# EAGLE schematic HE6-RORO1 (EAGLE 9.6.2)
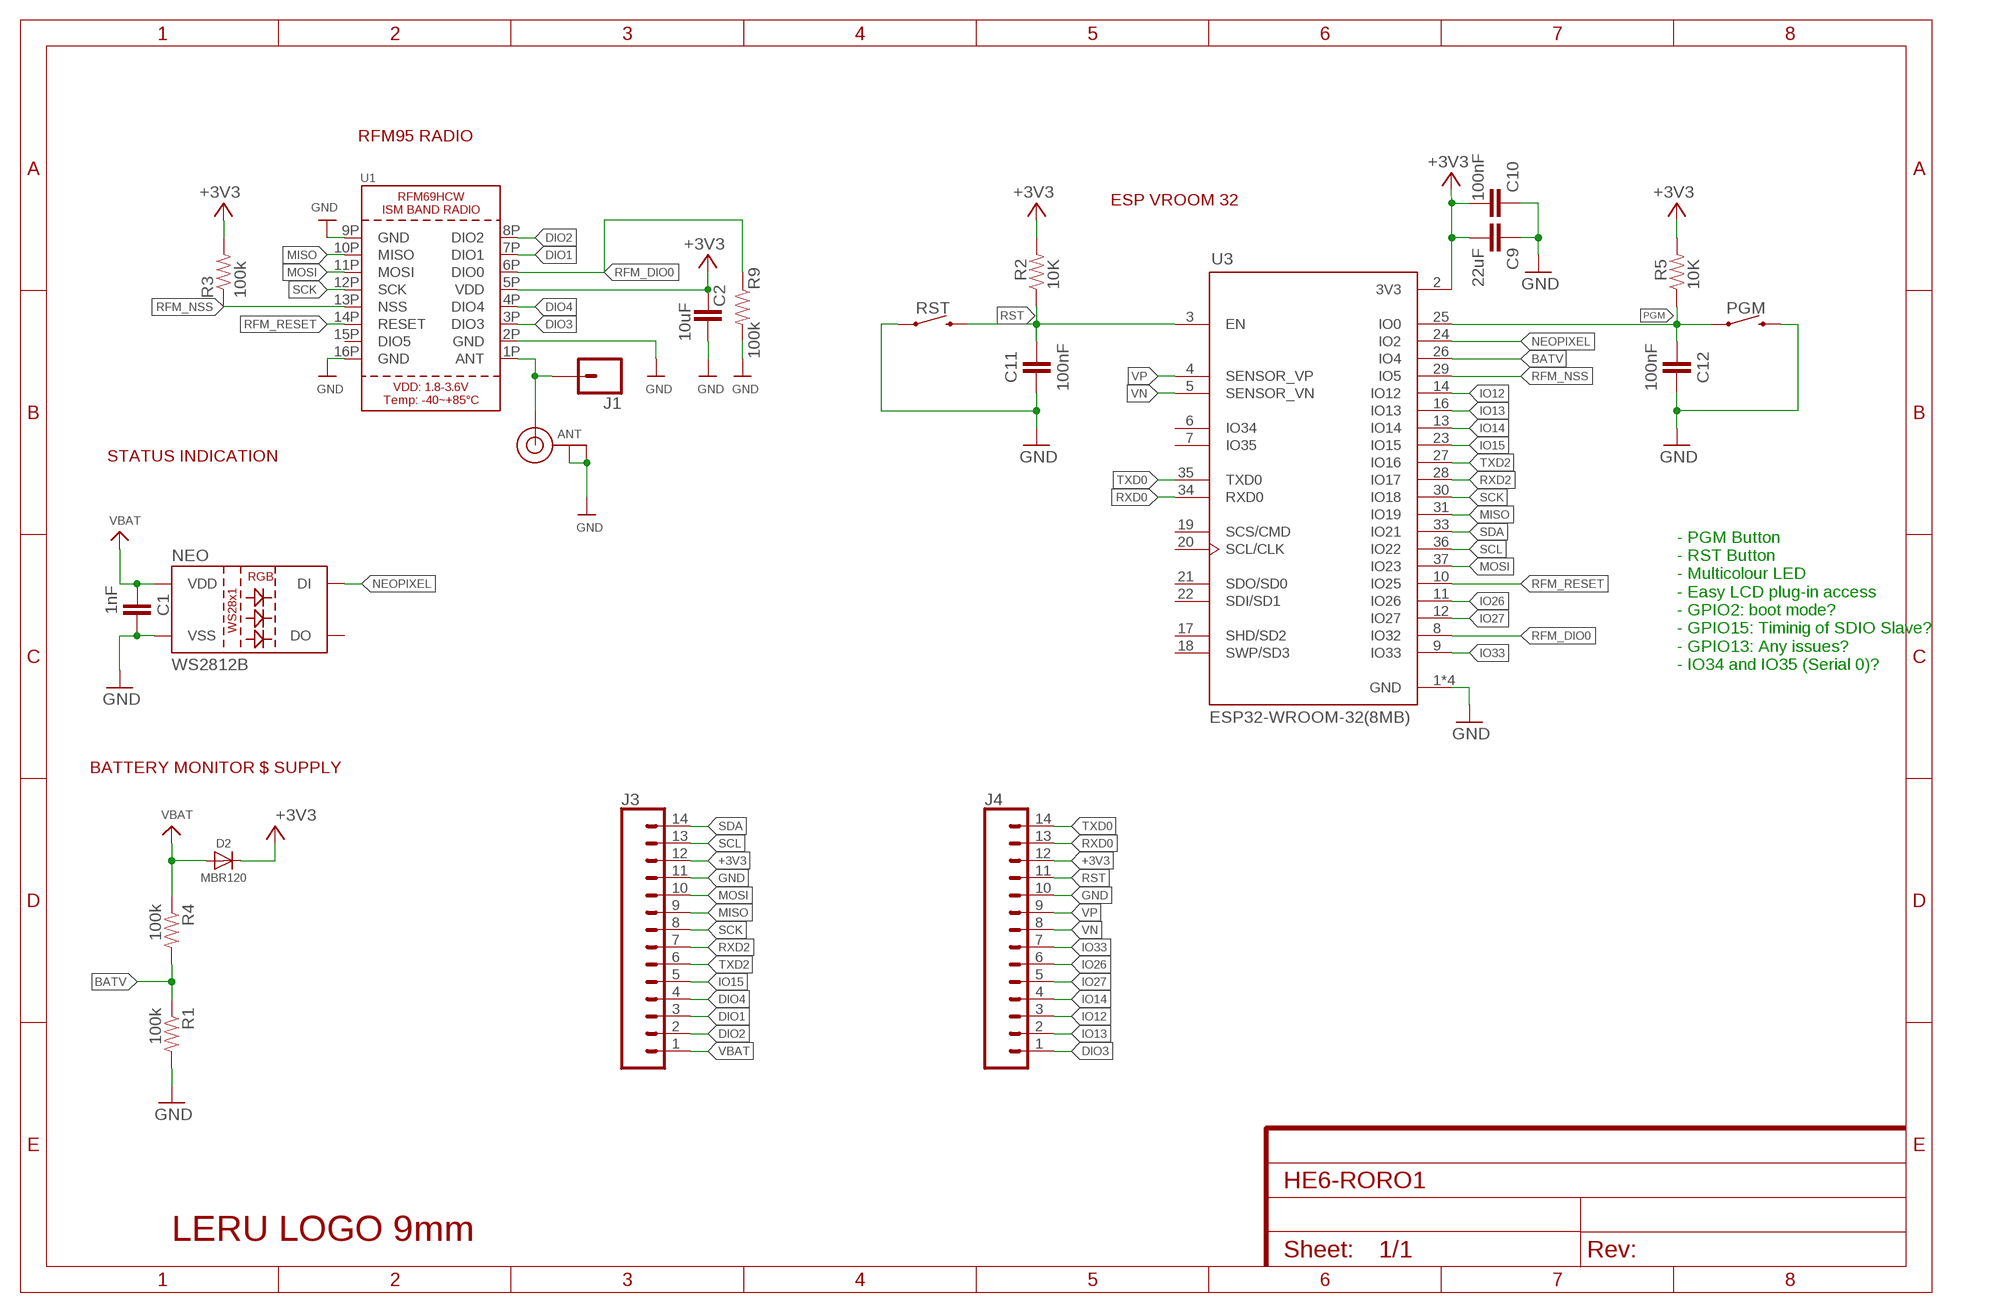
[diagram p0: schematic, sheet 1]

## Parts
ANT  MICROBUILDER_ANTENNA_U.FL  [MICROBUILDER_U.FL]
C1  1nF  CAP0805  [CAP]
C2  10uF  CAP0805  [CAP]
C9  22uF  CAP0805  [CAP]
C10  100nF  CAP0805  [CAP]
C11  100nF  CAP0805  [CAP]
C12  100nF  CAP0805  [CAP]
D2  MBR120  DIODESOD123  [DIODE]
J1  CONN_01PTH_NO_SILK_YES_STOP  [1X01_NO_SILK]
J3  CONN_14NO_SILK  [1X14_NO_SILK]
J4  CONN_14NO_SILK  [1X14_NO_SILK]
NEO  WS2812B  [WS2812B]
PGM  MOMENTARY-SWITCH-SPST-SMD-6.0X3.5MM  [TACTILE_SWITCH_SMD_6.0X3.5MM]
R1  100k  RES0805-RES  [RES]
R2  10K  RES0805-RES  [RES]
R3  100k  RES0805-RES  [RES]
R4  100k  RES0805-RES  [RES]
R5  10K  RES0805-RES  [RES]
R9  100k  RES0805-RES  [RES]
RST  MOMENTARY-SWITCH-SPST-SMD-6.0X3.5MM  [TACTILE_SWITCH_SMD_6.0X3.5MM]
U1  RFM69HCW_SMT  [RFMHCW_SMT]
U3  ESP32-WROOM-32(8MB)  [MODULE_ESP32-WROOM-32(8MB)]
U$9  LERU_LOGO_9MM  [LERU_LOGO_9MM]

## Nets
+3V3: C2.1 C9.2 C10.2 D2.1(C) J3.12 J4.12 R2.2 R3.2 R5.2 U1.5P(VDD) U3.2(3V3)
BATV: R1.1 R4.2 U3.26(IO4)
DIO1: J3.3 U1.7P(DIO1)
DIO2: J3.2 U1.8P(DIO2)
DIO3: J4.1 U1.3P(DIO3)
DIO4: J3.4 U1.4P(DIO4)
GND: ANT.1(GND) ANT.2(GND) C1.1 C2.2 C9.1 C10.1 C11.1 C12.1 J3.11 J4.10 NEO.3(VSS) PGM.2 R1.2 R9.2 RST.1 U1.2P(GND) U1.9P(GND) U1.16P(GND) U3.1(GND) U3.15(GND) U3.38(GND) U3.39(GND)
IO12: J4.3 U3.14(IO12)
IO13: J4.2 U3.16(IO13)
IO14: J4.4 U3.13(IO14)
IO15: J3.5 U3.23(IO15)
IO26: J4.6 U3.11(IO26)
IO27: J4.5 U3.12(IO27)
IO33: J4.7 U3.9(IO33)
MISO: J3.9 U1.10P(MISO) U3.31(IO19)
MOSI: J3.10 U1.11P(MOSI) U3.37(IO23)
N$1: ANT.3(SIGNAL) J1.1 U1.1P(ANT)
NEOPIXEL: NEO.4(DI) U3.24(IO2)
PGM: C12.2 PGM.1 R5.1 U3.25(IO0)
RFM_DIO0: R9.1 U1.6P(DIO0) U3.8(IO32)
RFM_NSS: R3.1 U1.13P(NSS) U3.29(IO5)
RFM_RESET: U1.14P(RESET) U3.10(IO25)
RST: C11.2 J4.11 R2.1 RST.2 U3.3(EN)
RXD0: J4.13 U3.34(RXD0)
RXD2: J3.7 U3.28(IO17)
SCK: J3.8 U1.12P(SCK) U3.30(IO18)
SCL: J3.13 U3.36(IO22)
SDA: J3.14 U3.33(IO21)
TXD0: J4.14 U3.35(TXD0)
TXD2: J3.6 U3.27(IO16)
VBAT: C1.2 D2.2(A) J3.1 NEO.1(VDD) R4.1
VN: J4.8 U3.5(SENSOR_VN)
VP: J4.9 U3.4(SENSOR_VP)
Unconnected: NEO.2(DO) U1.15P(DIO5) U3.6(IO34) U3.7(IO35) U3.17(SHD/SD2) U3.18(SWP/SD3) U3.19(SCS/CMD) U3.20(SCL/CLK) U3.21(SDO/SD0) U3.22(SDI/SD1)

## Notes on the sheet
- RFM95 RADIO
- ESP VROOM 32
- STATUS INDICATION
- - PGM Button
  - RST Button
  - Multicolour LED
  - Easy LCD plug-in access
  - GPIO2: boot mode?
  - GPIO15: Timinig of SDIO Slave?
  - GPIO13: Any issues?
  - IO34 and IO35 (Serial 0)?
- BATTERY MONITOR $ SUPPLY

## Library data of the parts
ANT = A-3-7-1-2-80:MICROBUILDER_ANTENNA_U.FL: U.FL Antenna Connector
C1 C2 C9-C12 = JLR:CAP: Capacitor Standard 0603 ceramic capacitor, and 0.1" leaded capacitor.
D2 = JLR:DIODE: DIODE unfilled
J1 = SparkFun-Connectors:CONN_01: Single connection point. Often used as Generic Header-pin footprint for 0.1 inch spaced/style header connections On any of the 0.1 inch spaced packages, you can populate with these: Break Away Headers - Straight <https://www.sparkfun.com/products/116> (PRT-00116) Break Away Male Headers - Right Angle <https://www.sparkfun.com/products/553> (PRT-00553) Female Headers <https://www.sparkfun.com/products/115> (PRT-00115) Break Away Headers - Machine Pin <https://www.sparkfun.com/products/117> (PRT-00117) Break Away Female Headers - Swiss Machine Pin <https://www.sparkfun.com/products/743> (PRT-00743) This device is also useful as a general connection point to wire up your design to another part of your project. Our various solder wires solder well into these plated through hole pads. Hook-Up Wire - Assortment (Stranded, 22 AWG) <https://www.sparkfun.com/products/11375> (PRT-11375) Hook-Up Wire - Assortment (Solid Core, 22 AWG) <https://www.sparkfun.com/products/11367> (PRT-11367) View the entire wire category on our website here <https://www.sparkfun.com/categories/141> Special notes: SMTSO-256-ET is a "flush mount" nut for a 4-40 screw. We mostly use this on specialty testbeds; it is a nice way to connect hardware to your PCB at an adjustable hieght. Also note, the SNAP packages are for using a snappable style connector. We sell a baggie of snaps and they are also used on two LilyPad designs: Snap Assortment - 30 pack (male and female) <https://www.sparkfun.com/products/11347> (DEV-11347) LilyPad Arduino SimpleSnap <https://www.sparkfun.com/products/10941> (DEV-10941) LilyPad SimpleSnap Protoboard <https://www.sparkfun.com/products/10940> (DEV-10940)
J3 J4 = SparkFun-Connectors:CONN_14: Multi connection point. Often used as Generic Header-pin footprint for 0.1 inch spaced/style header connections On any of the 0.1 inch spaced packages, you can populate with these: Break Away Headers - Straight <https://www.sparkfun.com/products/116> (PRT-00116) Break Away Male Headers - Right Angle <https://www.sparkfun.com/products/553> (PRT-00553) Female Headers <https://www.sparkfun.com/products/115> (PRT-00115) Break Away Headers - Machine Pin <https://www.sparkfun.com/products/117> (PRT-00117) Break Away Female Headers - Swiss Machine Pin <https://www.sparkfun.com/products/743> (PRT-00743) For SCREWTERMINALS and SPRING TERMINALS visit here: Screw Terimnals on SparkFun.com <https://www.sparkfun.com/search/results?term=Screw+Terminals> (5mm/3.5mm/2.54mm spacing) This device is also useful as a general connection point to wire up your design to another part of your project. Our various solder wires solder well into these plated through hole pads. Hook-Up Wire - Assortment (Stranded, 22 AWG) <https://www.sparkfun.com/products/11375> (PRT-11375) Hook-Up Wire - Assortment (Solid Core, 22 AWG) <https://www.sparkfun.com/products/11367> (PRT-11367) View the entire wire category on our website here <https://www.sparkfun.com/categories/141> Special notes: Molex polarized connector foot print use with SKU : PRT-08231 with associated crimp pins and housings. 1MM SMD Version SKU: PRT-10208 NOTES ON THE VARIANTS LOCK and LOCK_LONGPADS... This footprint was designed to help hold the alignment of a through-hole component (i.e. 6-pin header) while soldering it into place. You may notice that each hole has been shifted either up or down by 0.005 of an inch from it's more standard position (which is a perfectly straight line). This slight alteration caused the pins (the squares in the middle) to touch the edges of the holes. Because they are alternating, it causes a "brace" to hold the component in place. 0.005 has proven to be the perfect amount of "off-center" position when using our standard breakaway headers. Although looks a little odd when you look at the bare footprint, once you have a header in there, the alteration is very hard to notice. Also,if you push a header all the way into place, it is covered up entirely on the bottom side.
NEO = SparkFun-LED:WS2812B: WS2812B SMD addressable RGB LED 5x5mm SMD LED with built-in controller IC. Color: Red/Green/Blue mC Rating: RGB: 390, 660, 180 mcd Forward Voltage: RGB: 2.0, 3.0, 3.0 V Packages:WS2812B SparkFun Products: Blynk Board - ESP8266 <https://www.sparkfun.com/products/13794>; PROD_ID: DIO-12503
PGM RST = SparkFun-Switches:MOMENTARY-SWITCH-SPST: Momentary Switch (Pushbutton) - SPST Normally-open (NO) SPST momentary switches (buttons, pushbuttons). Variants PTH-12MM - 12mm square, through-hole Momentary Pushbutton Switch - 12mm Square <https://www.sparkfun.com/products/9190> (COM-09190) PTH-6.0MM, PTH-6.0MM-KIT - 6.0mm square, through-hole Mini Pushbutton Switch <https://www.sparkfun.com/products/97> (COM-00097) KIT package intended for soldering kit's - only one side of pads' copper is exposed. PTH-RIGHT-ANGLE-KIT - Right-angle, through-hole Right Angle Tactile Button <https://www.sparkfun.com/products/10791> - Used on SparkFun BigTime Watch Kit <https://www.sparkfun.com/products/11734> SMD-12MM - 12mm square, surface-mount Tactile Button - SMD (12mm) <https://www.sparkfun.com/products/12993> (COM-12993) Used on SparkFun PicoBoard <https://www.sparkfun.com/products/11888> SMD-4.5MM - 4.5mm Square Trackball Switch Used on SparkFun Blackberry Trackballer Breakout <https://www.sparkfun.com/products/13169> SMD-4.6MMX2.8MM - 4.60mm x 2.80mm, surface mount Used on SparkFun SAMD21 Mini Breakout <https://www.sparkfun.com/products/13664> SMD-5.2MM, SMD-5.2-REDUNDANT - 5.2mm square, surface-mount Mini Pushbutton Switch - SMD <https://www.sparkfun.com/products/8720> (COM-08720) Used on Arduino Pro Mini <https://www.sparkfun.com/products/11114> REDUNDANT package connects both switch circuits together SMD-6.0X3.5MM - 6.0 x 3.5mm, surface mount Momentary Reset Switch SMD <https://www.sparkfun.com/products/8229> (COM-08229) SMD-6.2MM-TALL - 6.2mm square, surface mount Tactile Button - SMD (6mm) <https://www.sparkfun.com/products/12992> Used on SparkFun Digital Sandbox <https://www.sparkfun.com/products/12651> SMD-RIGHT-ANGLE - Right-angle, surface mount Used on SparkFun Block for Intel® Edison - Arduino <https://www.sparkfun.com/products/13036>; PROD_ID: SWCH-00815; SF_SKU: COM-08229
R1-R5 R9 = JLR:RES: Resistor Basic schematic elements and footprints for 0603, 1206, and PTH resistors.
U1 = microbuilder:RFM69HCW: RFM69HCW - ISM Band RF Transceiver
U3 = ESP32-WROOM-32_8MB_:ESP32-WROOM-32(8MB): WIFI MODULE 64 MBITS SPI FLASH; AVAILABILITY: Unavailable; DESCRIPTION: Bluetooth, WiFi 802.11b/g/n, Bluetooth v4.2 + EDR, Class 1, 2 and 3 Transceiver Module 2.4GHz ~ 2.5GHz Surface Mount; MF: Espressif Systems; MP: ESP32-WROOM-32 _8MB_; PACKAGE: Module Espressif Systems; PRICE: None
U$9 = JLR:LERU_LOGO_9MM

## Net classes
1 vcc: width 0.254 mm